# Altium schematic sheet Core Analogue Inputs.SchDoc: RB25DET - Core Analogue Inputs
size A4; Address1: Drawn By:; Address2: Dan Visser; DocumentNumber: A; Revision: 0.1; SheetNumber: 4; SheetTotal: 12
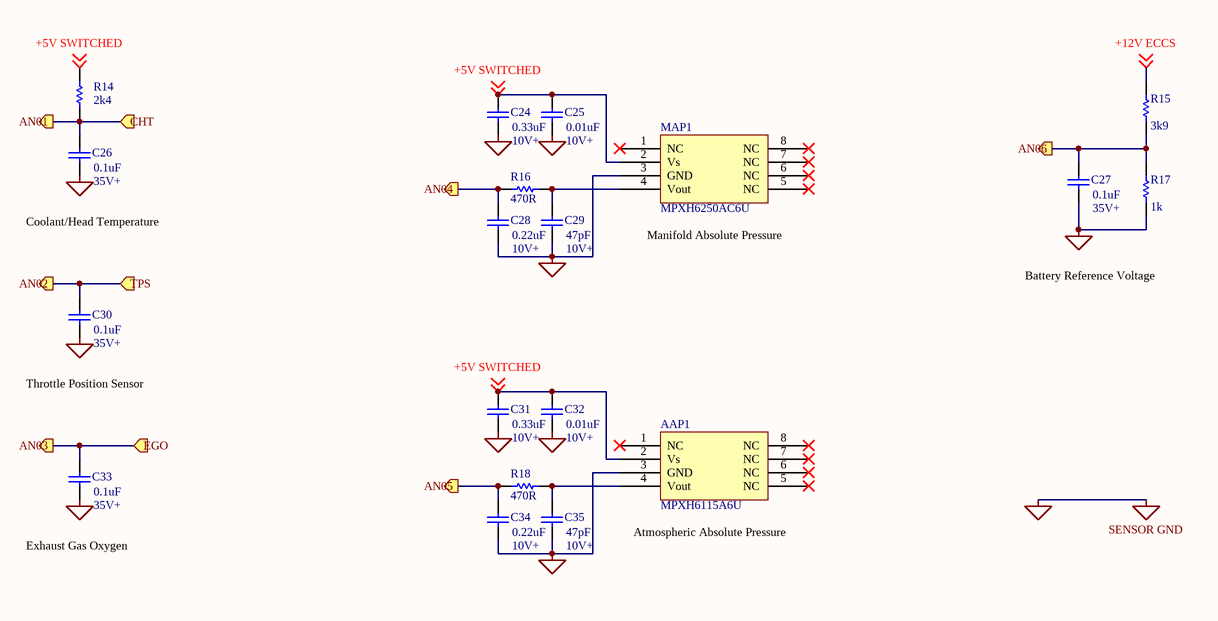
[diagram p0: Core Analogue Inputs.SchDoc]

## Parts
AAP1  MPXH6115A6U
C24  value 0.33uF  [RAD-0.3]
C25  value 0.01uF  [RAD-0.3]
C26  value 0.1uF  [RAD-0.3]
C27  value 0.1uF  [RAD-0.3]
C28  value 0.22uF  [RAD-0.3]
C29  value 47pF  [RAD-0.3]
C30  value 0.1uF  [RAD-0.3]
C31  value 0.33uF  [RAD-0.3]
C32  value 0.01uF  [RAD-0.3]
C33  value 0.1uF  [RAD-0.3]
C34  value 0.22uF  [RAD-0.3]
C35  value 47pF  [RAD-0.3]
MAP1  MPXH6250AC6U
R14  value 2k4  [AXIAL-0.3]
R15  value 3k9  [AXIAL-0.3]
R16  value 470R  [AXIAL-0.3]
R17  value 1k  [AXIAL-0.3]
R18  value 470R  [AXIAL-0.3]

## Ports
AN01 (out), AN02 (out), AN03 (out), AN04 (out), AN05 (out), AN06 (out), CHT (in), EGO (in), TPS (in)

## Nets
SENSOR GND: AAP1.3(GND) C24.1 C25.1 C26.1 C27.1 C28.1 C29.1 C30.1 C31.1 C32.1 C33.1 C34.1 C35.1 MAP1.3(GND) R17.1
+5V SWITCHED: AAP1.2(Vs) C24.2 C25.2 C31.2 C32.2 MAP1.2(Vs) R14.1 ; off-sheet +5V SWITCHED
+12V ECCS: R15.2 ; off-sheet +12V ECCS
AN01: C26.2 R14.2 ; port AN01, port CHT
AN02: C30.2 ; port AN02, port TPS
AN03: C33.2 ; port AN03, port EGO
AN04: C28.2 R16.1 ; port AN04
AN05: C34.2 R18.1 ; port AN05
AN06: C27.2 R15.1 R17.2 ; port AN06
NetAAP1_4: AAP1.4(Vout) C35.2 R18.2
NetC29_2: C29.2 MAP1.4(Vout) R16.2

Not connected (* = marked no-connect by the designer): AAP1 1(NC)* 5(NC)* 6(NC)* 7(NC)* 8(NC)*; MAP1 1(NC)* 5(NC)* 6(NC)* 7(NC)* 8(NC)*

## Notes on the sheet
- 10V+
- (near C25) 10V+
- Coolant/Head Temperature
- (near C26) 35V+
- (near MAP1) Manifold Absolute Pressure
- 35V+
- (near C29) 10V+
- Battery Reference Voltage
- (near C30) 35V+
- Throttle Position Sensor
- (near C32) 10V+
- (near C33) 35V+
- Exhaust Gas Oxygen
- (near C35) 10V+
- (near AAP1) Atmospheric Absolute Pressure
- Title
- Size:
- Date:
- A4
- Number:
- Time:
- Revision:
- Sheet
- of

## Library data of the parts
AAP1 = MPXH6115A6T1
C24-C35 = Cap: Capacitor; Published: 8-Jun-2000; LatestRevisionDate: 17-Jul-2002; LatestRevisionNote: Re-released for DXP Platform.; PackageReference: RAD-0.3; Publisher: Altium Limited; PackageDescription: Radial Cap, Thru-Hole; 2 Leads; 0.3 in Pin Spacing
R14-R18 = Res1: Resistor; Published: 8-Jun-2000; LatestRevisionDate: 17-Jul-2002; LatestRevisionNote: Re-released for DXP Platform.; PackageReference: AXIAL-0.3; Publisher: Altium Limited; PackageDescription: Axial Device, Thru-Hole; 2 Leads; 0.3 in Pin Spacing